# Altium project temperature_and_humidity_controller.PrjPcb
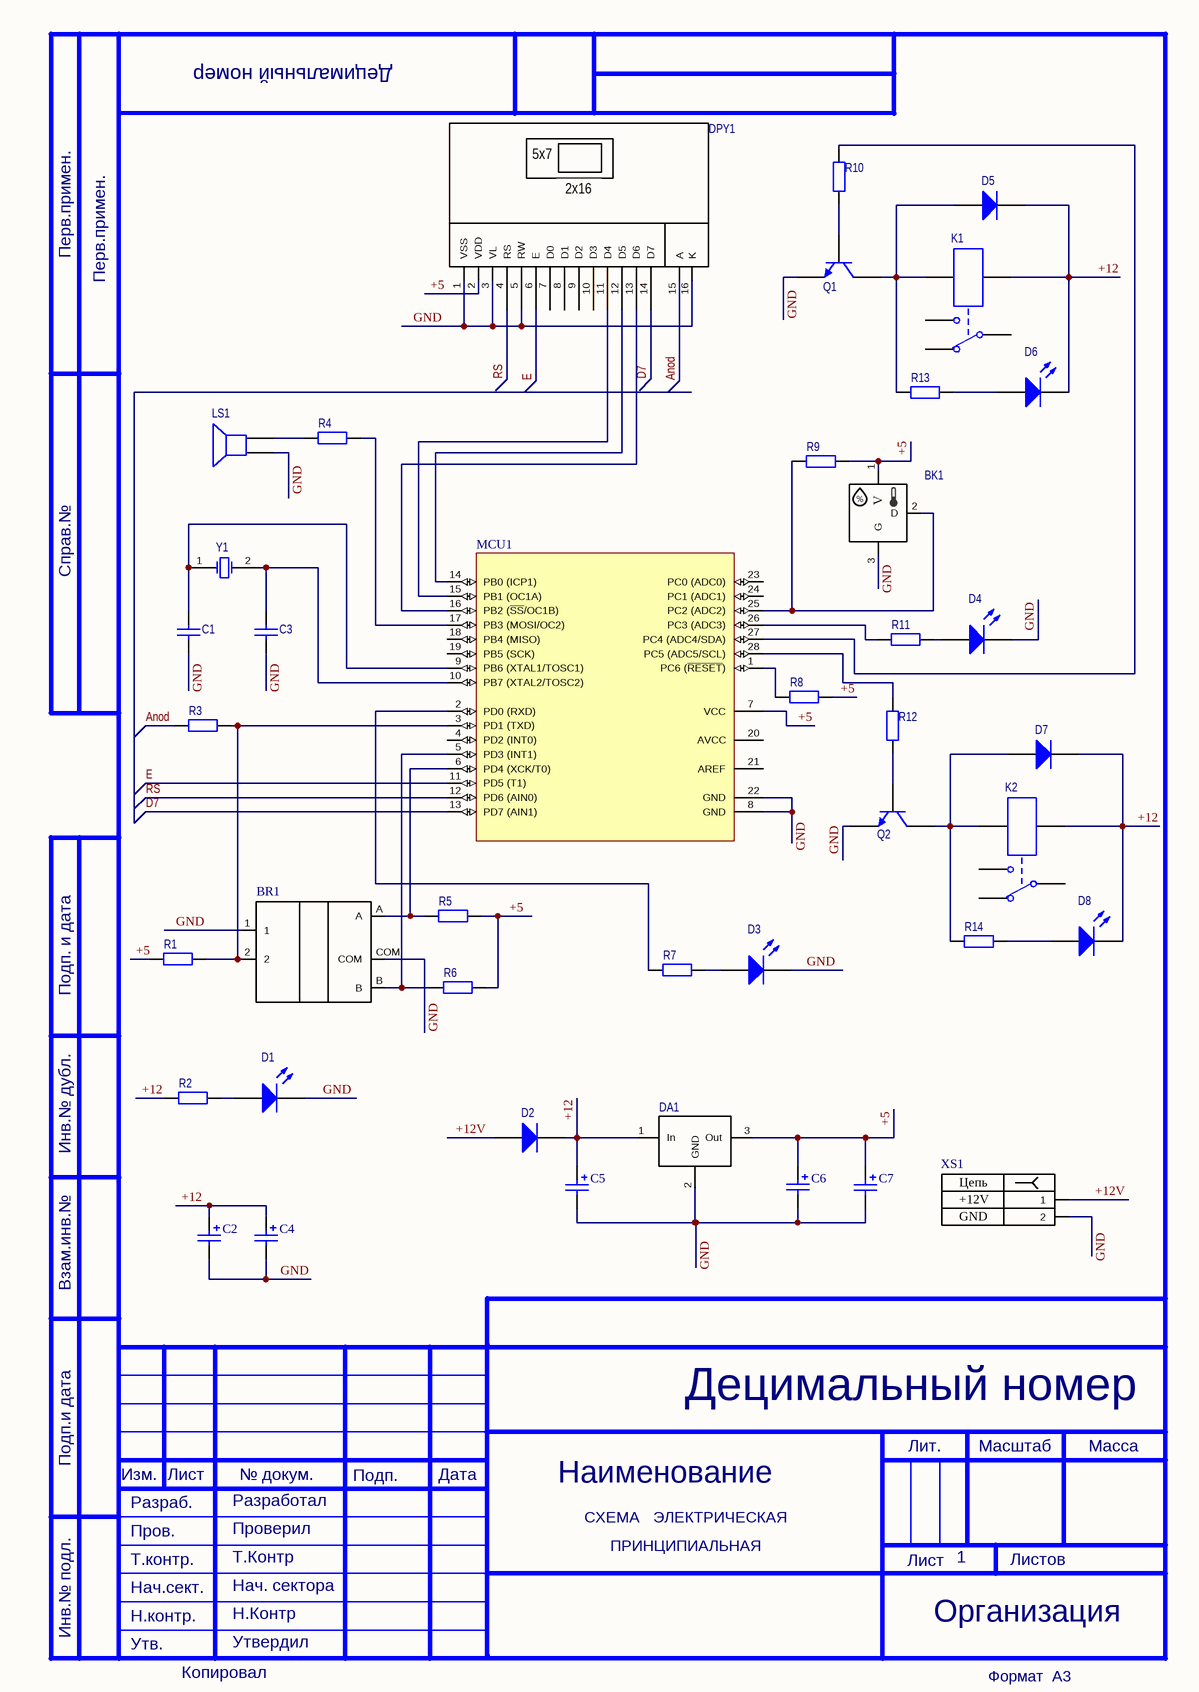
[diagram p0: Schem_controller.SchDoc]
1 sheet, 41 parts. Net scope: global (net labels, ports and power ports of the same name join across sheets).
Board file: Seets_controller.PcbDoc

## Sheet Schem_controller.SchDoc: Наименование
size 209 x 297 mm; Weight: -; ScaleFactor: -; NormInspection: Норм.Контр.; ApprovedBy: Утвердил; CheckedBy: Проверил; Author: Разработал; CompanyName: Организация; DrawnBy: Н.Контр; Engineer: Т.Контр; SheetNumber: 1; SheetTotal: 1; PageSetup: Record=PageOptions|CenterHorizontal=True|CenterVertical=True|PrintScale=0.94|XCorrection=1.00|YCorrection=1.00|PrintKind=1|BorderSize=5000000|LeftOffset=0|BottomOffset=0|Orientation=1|PaperLength=1000|PaperWidth=1000|Scale=100|PaperSource=7|PrintQuality=-4|MediaType=1|DitherType=10|PaperKind=A4|PrintScaleMode=1; DecimalNumber: Децимальный номер; HeadOfSector: Нач. сектора; MainDevice: Перв.примен.; Name: Наименование; DocumentName: Sheet1.SCHDOC

### Parts
BK1  (no value)  [WF_4]
BR1  PEC11R-4215F-S0024  [XDCR_PEC11R-4215F-S0024]  (value not drawn)
C1  (no value)  [RAD-0.3]
C2  (no value)  [POLAR0.8]
C3  (no value)  [RAD-0.3]
C4  (no value)  [POLAR0.8]
C5  (no value)  [POLAR0.8]
C6  (no value)  [POLAR0.8]
C7  (no value)  [POLAR0.8]
D1  (no value)  [LED-0]
D2  (no value)  [SMC]
D3  (no value)  [LED-0]
D4  (no value)  [LED-0]
D5  (no value)  [SMC]
D6  (no value)  [LED-0]
D7  (no value)  [SMC]
D8  (no value)  [LED-0]
DA1  (no value)  [TO220]
DPY1  (no value)  [LCDCHAR_16X2_BLU]
K1  (no value)  [MODULE5B]
K2  (no value)  [MODULE5B]
LS1  (no value)  [PIN2]
MCU1  ATmega8-16PU  [28P3]  (value not drawn)
Q1  (no value)  [TO-92A]
Q2  (no value)  [TO-92A]
R1  (no value)  [AXIAL-0.4]
R2  (no value)  [AXIAL-0.4]
R3  (no value)  [AXIAL-0.4]
R4  (no value)  [AXIAL-0.4]
R5  (no value)  [AXIAL-0.4]
R6  (no value)  [AXIAL-0.4]
R7  (no value)  [AXIAL-0.4]
R8  (no value)  [AXIAL-0.4]
R9  (no value)  [AXIAL-0.4]
R10  (no value)  [AXIAL-0.4]
R11  (no value)  [AXIAL-0.4]
R12  (no value)  [AXIAL-0.4]
R13  (no value)  [AXIAL-0.4]
R14  (no value)  [AXIAL-0.4]
XS1  Power_connector  [CUI_PJ-037AH]  (value not drawn)
Y1  (no value)  [R38]

### Nets
+5: BK1.1(V) C6.1 C7.1 DA1.3(Out) DPY1.2(VDD) MCU1.7(VCC) R1.1 R5.2 R6.2 R8.2 R9.2
+12: C2.1 C4.1 C5.1 D2.2(K) D5.2(K) D6.2(K) D7.2(K) D8.2(K) DA1.1(In) K1.4 K2.4 R2.1
+12V: D2.1(A) XS1.1
Anod: DPY1.15(A) R3.1
D7: DPY1.14(D7) MCU1.13(PD7_(AIN1))
E: DPY1.6(E) MCU1.11(PD5_(T1))
GND: BK1.3(G) BR1.1 BR1.COM C1.1 C2.2 C3.1 C4.2 C5.2 C6.2 C7.2 D1.2(K) D3.2(K) D4.2(K) DA1.2(GND) DPY1.1(VSS) DPY1.3(VL) DPY1.5(RW) DPY1.16(K) LS1.1 MCU1.8(GND) MCU1.22(GND) Q1.1(E) Q2.1(E) XS1.2
RS: DPY1.4(RS) MCU1.12(PD6_(AIN0))
NetBK1_2: BK1.2(D) MCU1.25(PC2_(ADC2)) R9.1
NetBR1_2: BR1.2 MCU1.3(PD1_(TXD)) R1.2 R3.2
NetBR1_A: BR1.A MCU1.6(PD4_(XCK/T0)) R5.1
NetBR1_B: BR1.B MCU1.5(PD3_(INT1)) R6.1
NetC1_2: C1.2 MCU1.9(PB6_(XTAL1/TOSC1)) Y1.1(OSC1)
NetC3_2: C3.2 MCU1.10(PB7_(XTAL2/TOSC2)) Y1.2(OSC2)
NetD1_1: D1.1(A) R2.2
NetD3_1: D3.1(A) R7.2
NetD4_1: D4.1(A) R11.2
NetD5_1: D5.1(A) K1.5 Q1.3(C) R13.1
NetD6_1: D6.1(A) R13.2
NetD7_1: D7.1(A) K2.5 Q2.3(C) R14.1
NetD8_1: D8.1(A) R14.2
NetDPY1_11: DPY1.11(D4) MCU1.15(PB1_(OC1A))
NetDPY1_12: DPY1.12(D5) MCU1.14(PB0_(ICP1))
NetDPY1_13: DPY1.13(D6) MCU1.16(PB2_(~{SS}/OC1B))
NetLS1_2: LS1.2 R4.1
NetMCU1_1: MCU1.1(PC6_(~{RESET})) R8.1
NetMCU1_2: MCU1.2(PD0_(RXD)) R7.1
NetMCU1_17: MCU1.17(PB3_(MOSI/OC2)) R4.2
NetMCU1_26: MCU1.26(PC3_(ADC3)) R11.1
NetMCU1_27: MCU1.27(PC4_(ADC4/SDA)) R10.2
NetMCU1_28: MCU1.28(PC5_(ADC5/SCL)) R12.2
NetQ1_2: Q1.2(B) R10.1
NetQ2_2: Q2.2(B) R12.1

Not connected (* = marked no-connect by the designer): BR1 S1(SHIELD) S2(SHIELD); DPY1 7(D0) 8(D1) 9(D2) 10(D3) MH1 MH2 MH3 MH4; K1 1 2 3; K2 1 2 3; MCU1 4(PD2_(INT0)) 18(PB4_(MISO)) 19(PB5_(SCK)) 20(AVCC) 21(AREF) 23(PC0_(ADC0)) 24(PC1_(ADC1))

### Notes on the sheet
- Перв.примен.
- Справ.№
- Подп. и дата
- Инв.№ дубл.
- Взам.инв.№
- Подп.и дата
- Разраб.
- Изм.
- Лист
- № докум.
- Подп.
- Дата
- Лит.
- Масштаб
- Масса
- Т.контр.
- Пров.
- СХЕМА   ЭЛЕКТРИЧЕСКАЯ
- ПРИНЦИПИАЛЬНАЯ
- Листов
- Инв.№ подл.
- Утв.
- Н.контр.
- Нач.сект.
- Копировал
- Формат  A3
- (in symbol LCDCHAR_16X2_BLU) 5x7; 2x16
- (in symbol Power_connector) Цепь; +12V; GND

### Library data of the parts
BK1 = HUM_AM2301: Sensor, Humidity+Temp, Digital, Capacitive; PARAM2: PARAM2
BR1 = PEC11R-4215F-S0024: Incremental Encoder, 12 Mm, Contact Rating 10 Ma - 5 Vdc; Package: None; Availability: Unavailable; Value: *; MP: PEC11R-4215F-S0024; Price: None
C1 C3 = Cap: Capacitor; Published: 8-Jun-2000; LatestRevisionDate: 17-Jul-2002; LatestRevisionNote: Re-released for DXP Platform.; PackageReference: RAD-0.3; Publisher: Altium Limited; PackageDescription: Radial Cap, Thru-Hole; 2 Leads; 0.3 in Pin Spacing
C2 C4-C7 = Cap Pol2: Polarized Capacitor (Axial); Published: 8-Jun-2000; LatestRevisionDate: 17-Jul-2002; LatestRevisionNote: Re-released for DXP Platform.; PackageReference: POLAR0.8; Publisher: Altium Limited; PackageDescription: Polarized Capacitor; 2 Leads
D1 D3 D4 D6 D8 = LED0: Typical INFRARED GaAs LED; Published: 8-Jun-2000; LatestRevisionDate: 08-Jul-2005; LatestRevisionNote: Mech Layer 1 removed.; PackageReference: LED-0; Publisher: Altium Limited; PackageDescription: LED; 2 Leads
D2 D5 D7 = Diode: Default Diode; Published: 8-Jun-2000; LatestRevisionDate: 17-Jul-2002; LatestRevisionNote: Re-released for DXP Platform.; PackageVersion: Sep-1996; PackageReference: SMC; Publisher: Altium Limited; PackageDescription: DO-214-AB/SMC; 2 C-Bend Leads; Body 7.9 x 5.9 mm, inc. leads (LxW); Code_JEDEC: DO-214-AB
DA1 = LM7805: IC REG LIN 5V 1A
DPY1 = LCDCHAR_16X2_BLU: LCD Character Disp, 16X2; MANF: Newhaven; MANF_P#: NHD-0216K3Z-NSW-BBW-V3; PARAM2: Blue back, White, 5V; PARAM: 2 lines x 16 characters
K1 K2 = Relay-SPDT: Single-Pole Dual-Throw Relay; Published: 24-Mar-1999; LatestRevisionDate: 17-Jul-2002; LatestRevisionNote: Re-released for DXP Platform.; PackageReference: MODULE5B; Publisher: Altium Limited
LS1 = Speaker: Loudspeaker; Published: 24-Mar-1999; LatestRevisionDate: 17-Jul-2002; LatestRevisionNote: Re-released for DXP Platform.; PackageReference: PIN2; Publisher: Altium Limited
MCU1 = CMP-0095-00372-1: 8-bit AVR Microcontroller, 4.5-5.5V, 16MHz, 8KB Flash, 512 Bytes EEPROM, 1KB SRAM, 28-pin PDIP, Industrial Grade (-40°C to 85°C); ComponentLink3URL: http://www.atmel.com/dyn/resources/prod_documents/2486S.pdf; ComponentLink3Description: ATmega8(L) Summary; PackageDescription: 28-lead (0.300"/7.62mm Wide) Plastic Dual Inline Package (PDIP); ComponentLink2Description: ATmega8(L); ComponentLink1URL: http://www.atmel.com/; PackageVersion: revB, Sep-2001; ComponentLink1Description: Manufacturer URL; ComponentLink2URL: http://www.atmel.com/dyn/resources/prod_documents/doc2486.pdf; PackageReference: 28P3; DatasheetVersion: revZ, Feb-2011
Q1 Q2 = 2N3904: NPN General Purpose Amplifier; Published: 8-Jun-2000; LatestRevisionDate: 15-Jan-2003; LatestRevisionNote: PCB Footprint 'BCY-W3/D4.7' replaced; DatasheetVersion: 1997; PackageVersion: Sep-1998; PackageReference: TO-92A; Publisher: Altium Limited; PackageDescription: TO, Flat Index; 3 In-Line, Axial Leads; Body Dia. 4.5mm; Leads 0.51 x 0.48 mm (max); ComponentLink1Description: Manufacturer Link; ComponentLink1URL: http://www.fairchildsemi.com/; ComponentLink2Description: Datasheet; ComponentLink2URL: http://www.fairchildsemi.com/ds/2N%2F2N3904.pdf
R1-R14 = Res2: Resistor; Published: 8-Jun-2000; LatestRevisionDate: 17-Jul-2002; LatestRevisionNote: Re-released for DXP Platform.; PackageReference: AXIAL-0.4; Publisher: Altium Limited; PackageDescription: Axial Device, Thru-Hole; 2 Leads; 0.4 in Pin Spacing
Y1 = XTAL: Crystal Oscillator; Published: 8-Jun-2000; LatestRevisionDate: 17-Jul-2002; LatestRevisionNote: Re-released for DXP Platform.; PackageReference: R38; Publisher: Altium Limited; PackageDescription: Crystal, Thru-Hole; 2 Leads; Body 3.1 x 8.2 mm (Dia.xH)